# Altium schematic sheet ALLPRINT-CAPBOARD-677512-SIGNAL-OUTPUTS.SchDoc
size A3; Organization: Altium Limited; Address1: 3 Minna Close; Address2: Belrose; Address3: NSW 2085; Address4: Australia; DocumentNumber: 7; SheetNumber: 6; SheetTotal: 11
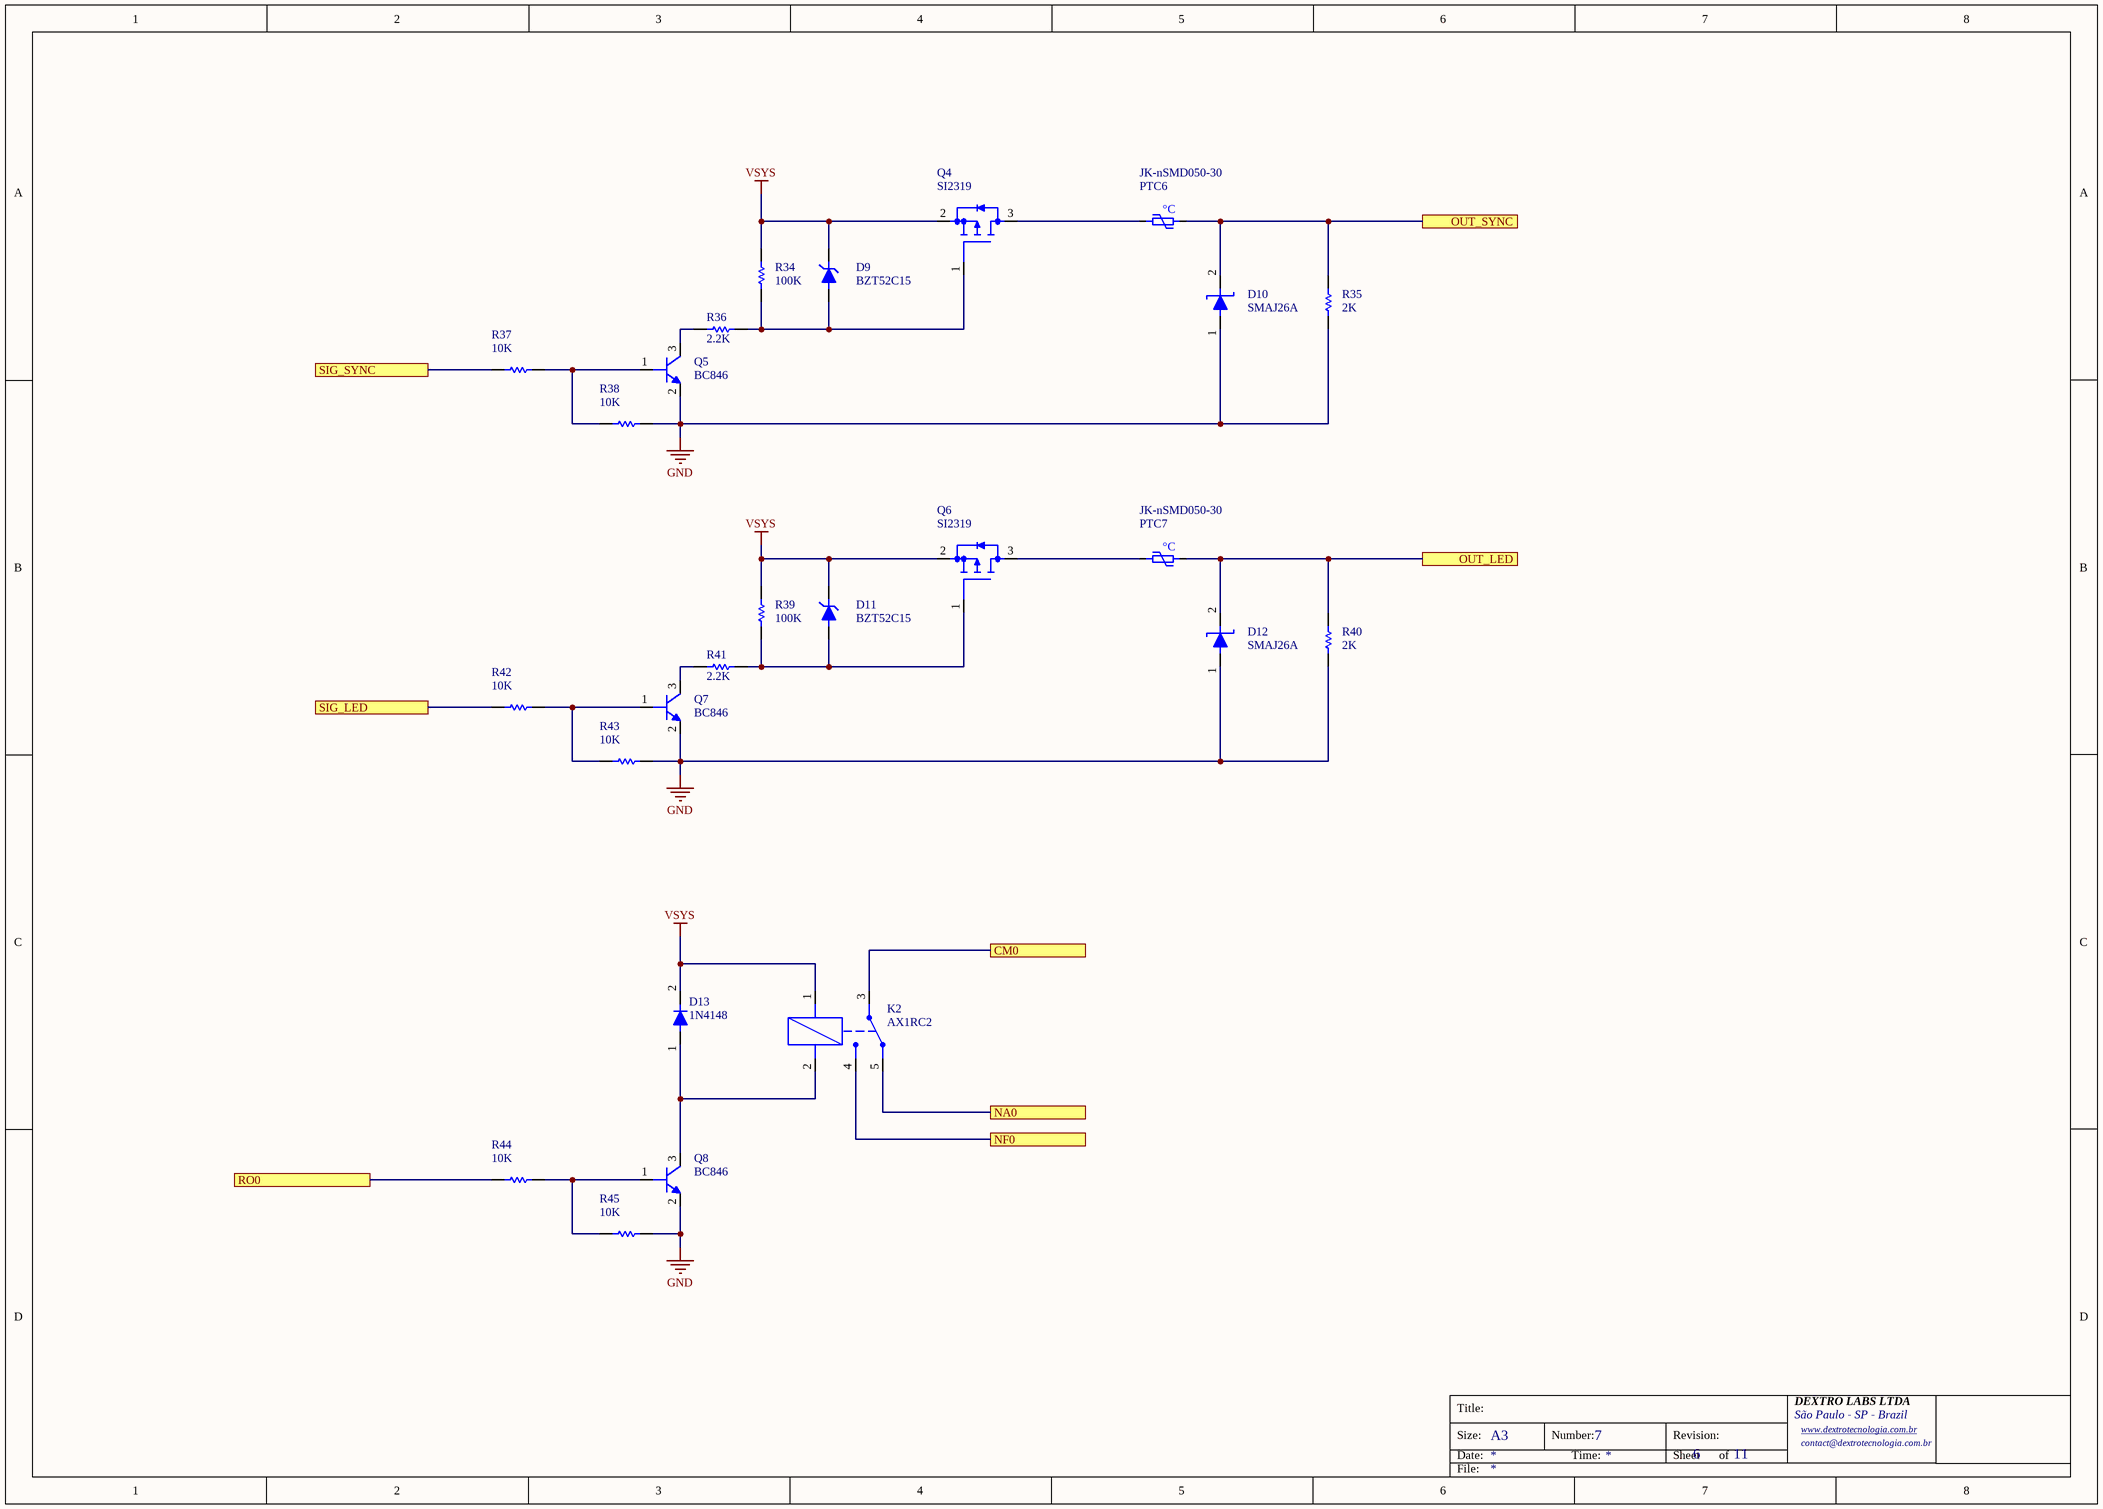
[diagram p0: ALLPRINT-CAPBOARD-677512-SIGNAL-OUTPUTS.SchDoc]

## Parts
D9  BZT52C15  [SOD123]
D10  SMAJ26A  [DO214-AC (SMA)]
D11  BZT52C15  [SOD123]
D12  SMAJ26A  [DO214-AC (SMA)]
D13  1N4148  [SOD123]
K2  AX1RC2  [METALTEX-AX1]
PTC6  JK-nSMD050-30  [PTC-1206]
PTC7  JK-nSMD050-30  [PTC-1206]
Q4  SI2319  [SOT23-3]
Q5  BC846  [SOT23-3]
Q6  SI2319  [SOT23-3]
Q7  BC846  [SOT23-3]
Q8  BC846  [SOT23-3]
R34  100K  [RES-0603]
R35  2K  [RES-1206]
R36  2.2K  [RES-0805]
R37  10K  [RES-0603]
R38  10K  [RES-0603]
R39  100K  [RES-0603]
R40  2K  [RES-1206]
R41  2.2K  [RES-0805]
R42  10K  [RES-0603]
R43  10K  [RES-0603]
R44  10K  [RES-0603]
R45  10K  [RES-0603]

## Ports
CM0 (see ALLPRINT-CAPBOARD-677512-GENERAL[4A]), NA0 (see ALLPRINT-CAPBOARD-677512-GENERAL[4A]), NF0 (see ALLPRINT-CAPBOARD-677512-GENERAL[4A]), OUT_LED (see ALLPRINT-CAPBOARD-677512-GENERAL[4A]), OUT_SYNC (see ALLPRINT-CAPBOARD-677512-GENERAL[4A]), RO0 (see ALLPRINT-CAPBOARD-677512-GENERAL[3A], ALLPRINT-CAPBOARD-677512-MCU[1B]), SIG_LED (see ALLPRINT-CAPBOARD-677512-GENERAL[3A], ALLPRINT-CAPBOARD-677512-MCU[5B]), SIG_SYNC (see ALLPRINT-CAPBOARD-677512-GENERAL[3A], ALLPRINT-CAPBOARD-677512-MCU[5B])

## Nets
GND: D10.1(A) D12.1(A) Q5.2 Q7.2 Q8.2 R35.1 R38.1 R40.1 R43.1 R45.2
VSYS: D9.2 D11.2 D13.2(K) K2.1 Q4.2(S) Q6.2(S) R34.2 R39.2
CM0: K2.3 ; port CM0
NA0: K2.5 ; port NA0
NF0: K2.4 ; port NF0
OUT_LED: D12.2(K) PTC7.2 R40.2 ; port OUT_LED
OUT_SYNC: D10.2(K) PTC6.2 R35.2 ; port OUT_SYNC
RO0: R44.1 ; port RO0
SIG_LED: R42.2 ; port SIG_LED
SIG_SYNC: R37.2 ; port SIG_SYNC
NetD9_1: D9.1 Q4.1(G]) R34.1 R36.1
NetD11_1: D11.1 Q6.1(G]) R39.1 R41.1
NetD13_1: D13.1(A1) K2.2 Q8.3
NetPTC6_1: PTC6.1 Q4.3(D)
NetPTC7_1: PTC7.1 Q6.3(D)
NetQ5_1: Q5.1 R37.1 R38.2
NetQ5_3: Q5.3 R36.2
NetQ7_1: Q7.1 R42.1 R43.2
NetQ7_3: Q7.3 R41.2
NetQ8_1: Q8.1 R44.2 R45.1

## Notes on the sheet
- Title:
- Size:
- Date:
- A3
- Number:
- Time:
- Revision:
- Sheet
- of
- DEXTRO LABS LTDA
- São Paulo - SP - Brazil
- www.dextrotecnologia.com.br <http://www.dextrotecnologia.com.br>
- contact@dextrotecnologia.com.br
- File:
- (in symbol PTC-FUSE-30V-500mA-1206) °C

## Library data of the parts
D9 D11 = BZT52C15: DIODO ZENER 15V-500mW-SOD123; LCSC: C266569
D10 D12 = SMAJ26A: 28.9V 26V 9.5A 42.1V 400W Unidirectional DO-214AC(SMA) TVS Diodes RoHS; LCSC: C2848697
D13 = 1N4148: 1A 4ns 75V Independent 1V@50mA 150mA SOD-123 Single Diodes RoHS; LCSC: C241939
K2 = AX1RC2: RELÉ-METALTEX-BOBINA 12V-15A-SPDT
PTC6 PTC7 = PTC-FUSE-30V-500mA-1206: 30V 500mA 100A 1A 150mΩ 1206 PTC Resettable Fuses ROHS; LCSC: C720075
Q4 Q6 = SI2319: P-Channel 40V 5A 1.4W Surface Mount SOT-23; LCSC: C5337197
Q5 Q7 Q8 = TRANSISTOR-BC846B,215-SOT23: 65V 200@10mA,5V 250mW 100mA NPN SOT-23 Bipolar (BJT) ROHS; LCSC: C87062
R34 R39 = RES-100K-1%-100mW-0603: 100mW Thick Film Resistor 75V ±100ppm/℃ ±1% 100kΩ 0603 Chip Resistor - Surface Mount ROHS; LCSC: C14675
R35 R40 = RES-2K-1%-250mW-1206: 250mW Thick Film Resistor 200V ±100ppm/℃ ±5% 2kΩ 1206 Chip Resistor - Surface Mount ROHS; LCSC: C2907466
R36 R41 = RES-2.2K-1%-125mW-0805: 125mW 2.2kΩ 150V ±100ppm/℃ Thick Film Resistor ±1% 0805 Chip Resistor - Surface Mount ROHS; LCSC: C2907234
R37 R38 R42-R45 = RES-10K-1%-100mW-0603: 100mW Thick Film Resistor 75V ±100ppm/℃ ±1% 10kΩ 0603 Chip Resistor - Surface Mount ROHS; LCSC: C98220